# Altium schematic sheet 01-TableOfContents.SchDoc
size A; SheetNumber: 1; SheetTotal: 1
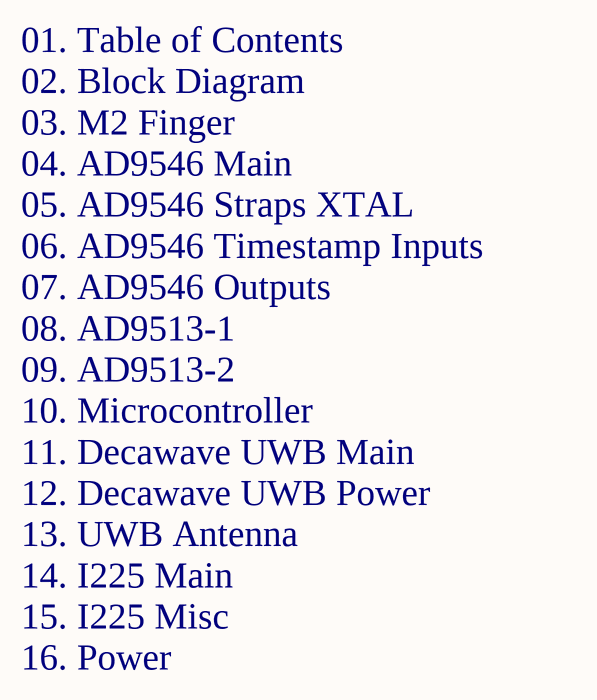
[diagram p0: 01-TableOfContents.SchDoc]

## Notes on the sheet
- 01. Table of Contents
- 02. Block Diagram
- 03. M2 Finger
- 04. AD9546 Main
- 05. AD9546 Straps XTAL
- 06. AD9546 Timestamp Inputs
- 07. AD9546 Outputs
- 08. AD9513-1
- 09. AD9513-2
- 10. Microcontroller
- 11. Decawave UWB Main
- 12. Decawave UWB Power
- 13. UWB Antenna
- 14. I225 Main
- 15. I225 Misc
- 16. Power